# EAGLE design Button_PCBA (EAGLE 9.6.2)
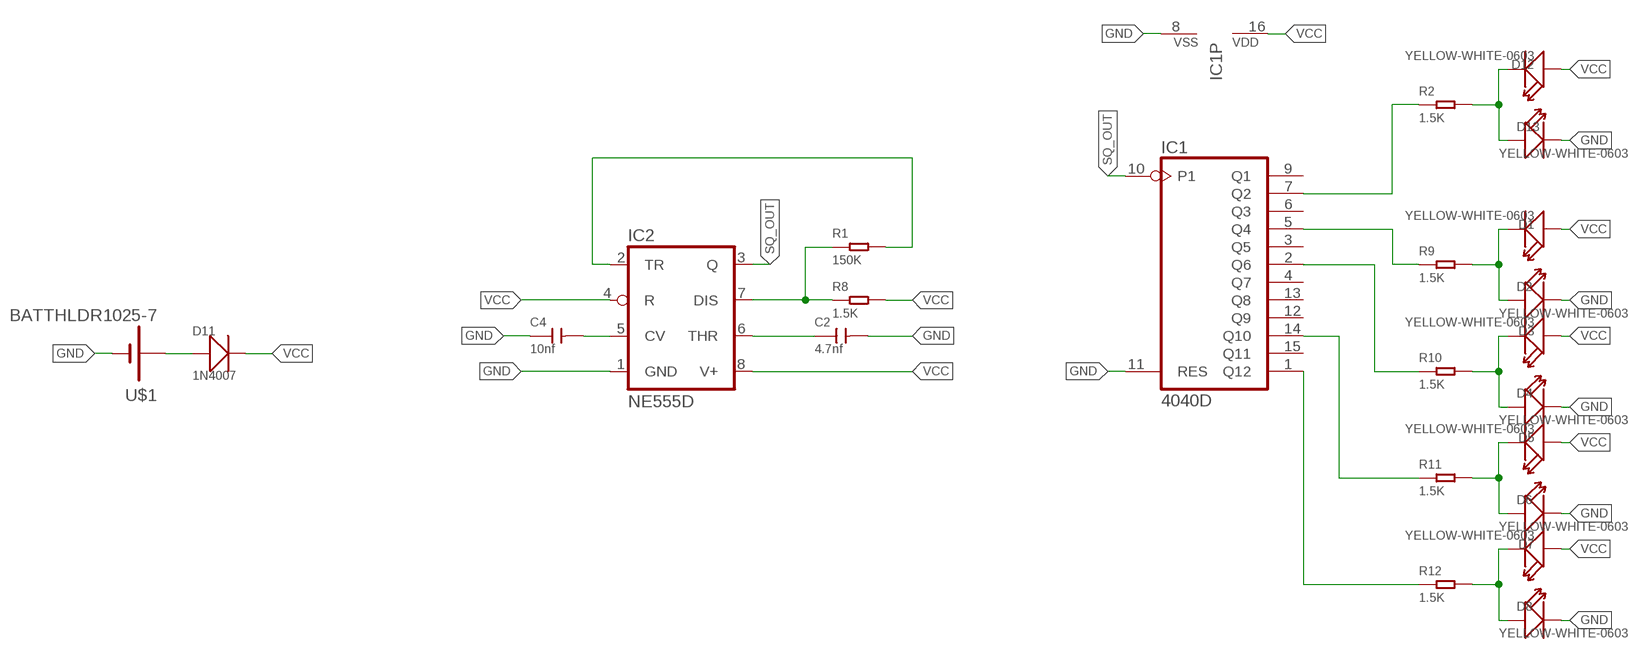
[diagram p0: schematic, sheet 1]

## Parts
C2  4.7nf  CERAMIC-4.7NF-50V-10%-X7R(0603)  [C0603]
C4  10nf  CERAMIC-10NF-50V-10%-X7R(0603)  [C0603]
D1  YELLOW-WHITE-0603  SMD-LED-YELLOW-WHITE(0603)  [LED-0603]
D2  YELLOW-WHITE-0603  SMD-LED-YELLOW-WHITE(0603)  [LED-0603]
D3  YELLOW-WHITE-0603  SMD-LED-YELLOW-WHITE(0603)  [LED-0603]
D4  YELLOW-WHITE-0603  SMD-LED-YELLOW-WHITE(0603)  [LED-0603]
D5  YELLOW-WHITE-0603  SMD-LED-YELLOW-WHITE(0603)  [LED-0603]
D6  YELLOW-WHITE-0603  SMD-LED-YELLOW-WHITE(0603)  [LED-0603]
D7  YELLOW-WHITE-0603  SMD-LED-YELLOW-WHITE(0603)  [LED-0603]
D8  YELLOW-WHITE-0603  SMD-LED-YELLOW-WHITE(0603)  [LED-0603]
D11  1N4007  DIODE-GEN-PURPOSE-1KV-1A(DO-214AC)  [DO-214AC]
D12  YELLOW-WHITE-0603  SMD-LED-YELLOW-WHITE(0603)  [LED-0603]
D13  YELLOW-WHITE-0603  SMD-LED-YELLOW-WHITE(0603)  [LED-0603]
IC1  4040D  [SO16]
IC2  NE555D  [SO08]
R1  150K  SMD-RES-150K-1%-1/10W(0603)  [R0603]
R2  1.5K  SMD-RES-680R-1%-1/10W(0603)  [R0603]
R8  1.5K  SMD-RES-4.7K-1%-1/10W(0603)  [R0603]
R9  1.5K  SMD-RES-680R-1%-1/10W(0603)  [R0603]
R10  1.5K  SMD-RES-680R-1%-1/10W(0603)  [R0603]
R11  1.5K  SMD-RES-680R-1%-1/10W(0603)  [R0603]
R12  1.5K  SMD-RES-680R-1%-1/10W(0603)  [R0603]
U$1  BATTHLDR1025-7  [BATTHLDR1025-7]

## Nets
+VBAT: D11.1(+) U$1.POSITIVE(+)
GND: C2.2 C4.1 D2.- D4.- D6.- D8.- D13.- IC1.8(VSS) IC1.11(RES) IC2.1(GND) U$1.NEGATIVE(-)
N$1: C2.1 IC2.6(THR)
N$2: IC2.7(DIS) R1.1 R8.1
N$3: IC2.2(TR) R1.2
N$4: C4.2 IC2.5(CV)
N$5: D12.- D13.+ R2.2
N$6: IC1.7(Q2) R2.1
N$7: D1.- D2.+ R9.2
N$8: IC1.5(Q4) R9.1
N$9: D3.- D4.+ R10.2
N$10: IC1.2(Q6) R10.1
N$11: D5.- D6.+ R11.2
N$12: IC1.14(Q10) R11.1
N$13: D7.- D8.+ R12.2
N$14: IC1.1(Q12) R12.1
SQ_OUT: IC1.10(P1) IC2.3(Q)
VCC: D1.+ D3.+ D5.+ D7.+ D11.2(-) D12.+ IC1.16(VDD) IC2.4(R) IC2.8(V+) R8.2
Unconnected: IC1.3(Q5) IC1.4(Q7) IC1.6(Q3) IC1.9(Q1) IC1.12(Q9) IC1.13(Q8) IC1.15(Q11)

## Library data of the parts
C2 = OPL_Capacitor:CERAMIC-4.7NF-50V-10%-X7R(0603): 302010144; MPN: CC0603KRX7R9BB472
C4 = OPL_Capacitor:CERAMIC-10NF-50V-10%-X7R(0603): 302010140; MPN: CC0603KRX7R9BB103
D1-D8 D12 D13 = OPL_Optoelectronics:SMD-LED-YELLOW-WHITE(0603): 304090071; MPN: ADL-0603W
D11 = OPL_Discrete_Semiconductor:DIODE-GEN-PURPOSE-1KV-1A(DO-214AC): 304010013; MPN: 1N4007
IC1 = 40xx:4040: 12-stage binary/ripple COUNTER
IC2 = linear:*555: TIMER
R1 = OPL_Resistor:SMD-RES-150K-1%-1/10W(0603): 301012036; MPN: RC0603FR-07150KL
R2 R9-R12 = OPL_Resistor:SMD-RES-680R-1%-1/10W(0603): 301012092; MPN: RC0603FR-071K5L
R8 = OPL_Resistor:SMD-RES-4.7K-1%-1/10W(0603): 301012079; MPN: RC0603FR-071K5L
U$1 = BATT_HLDR_COIN:BATTHLDR1025-7

## Net classes
0 default: width 0.305 mm, drill 0.305 mm, clearance 0.305 mm

## Board
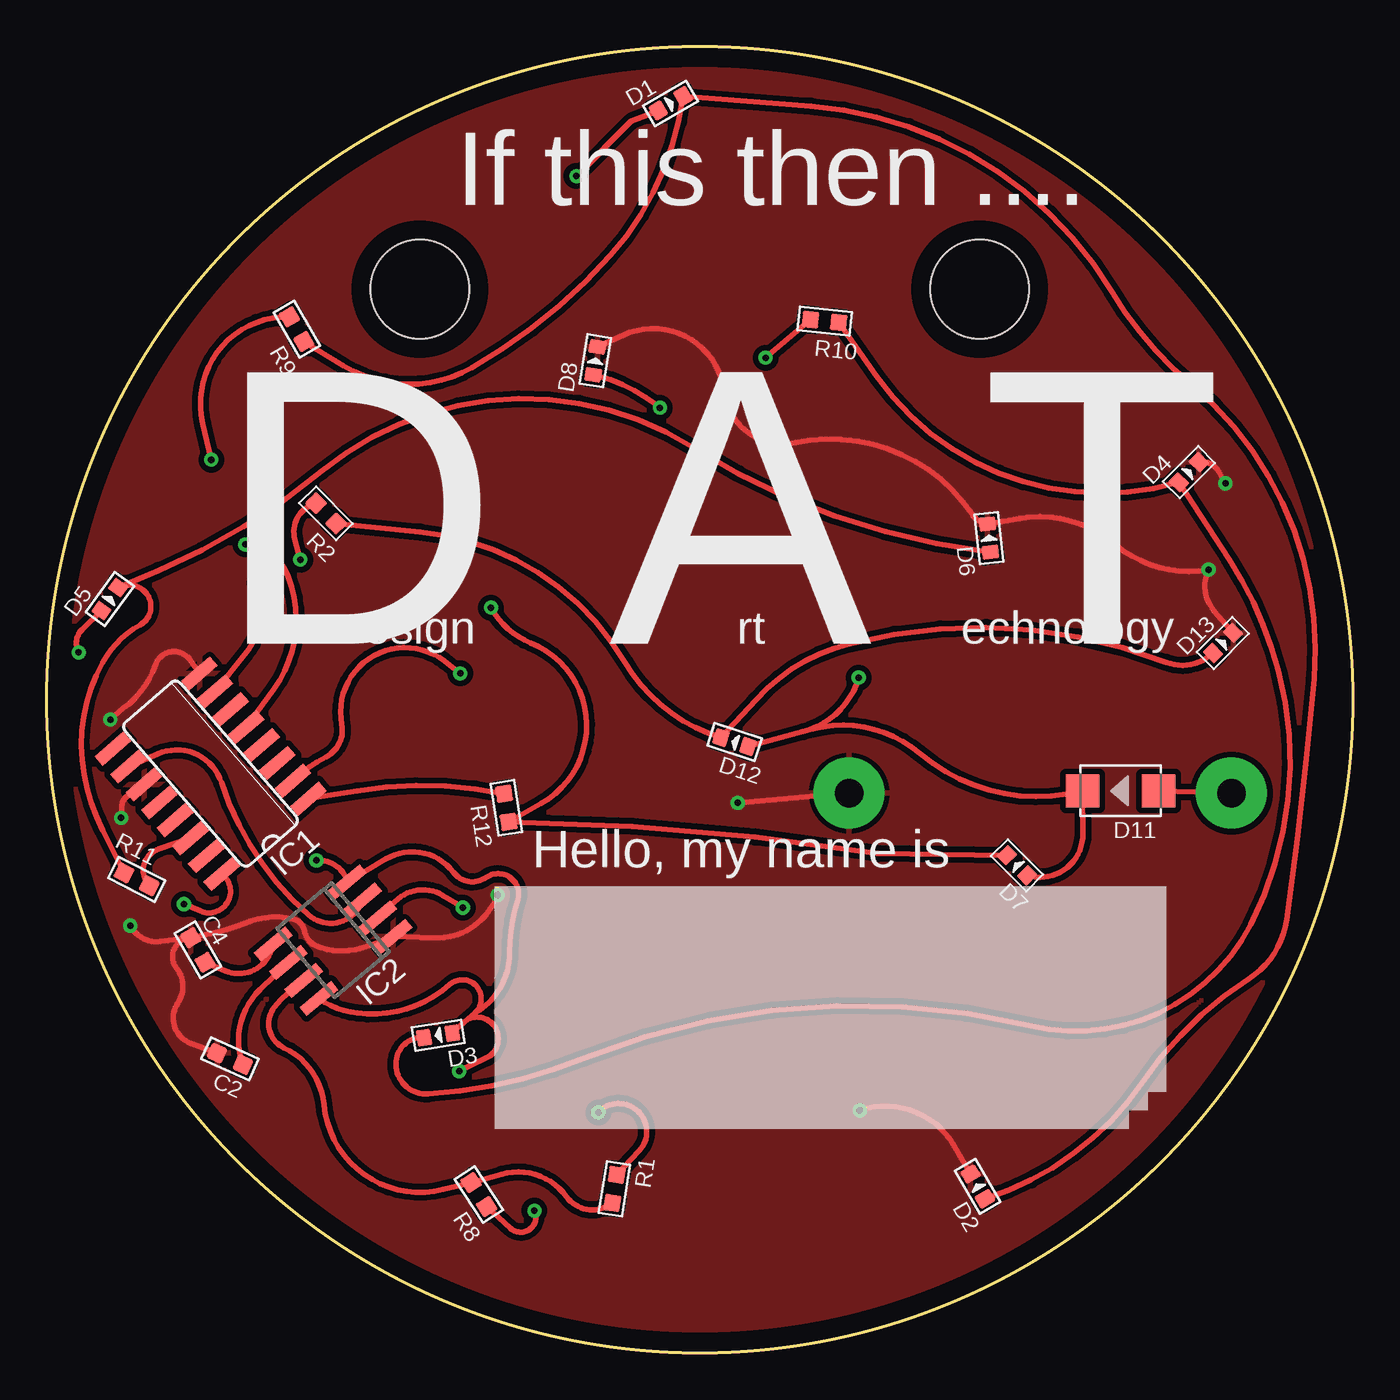
[diagram p1: board, top side]
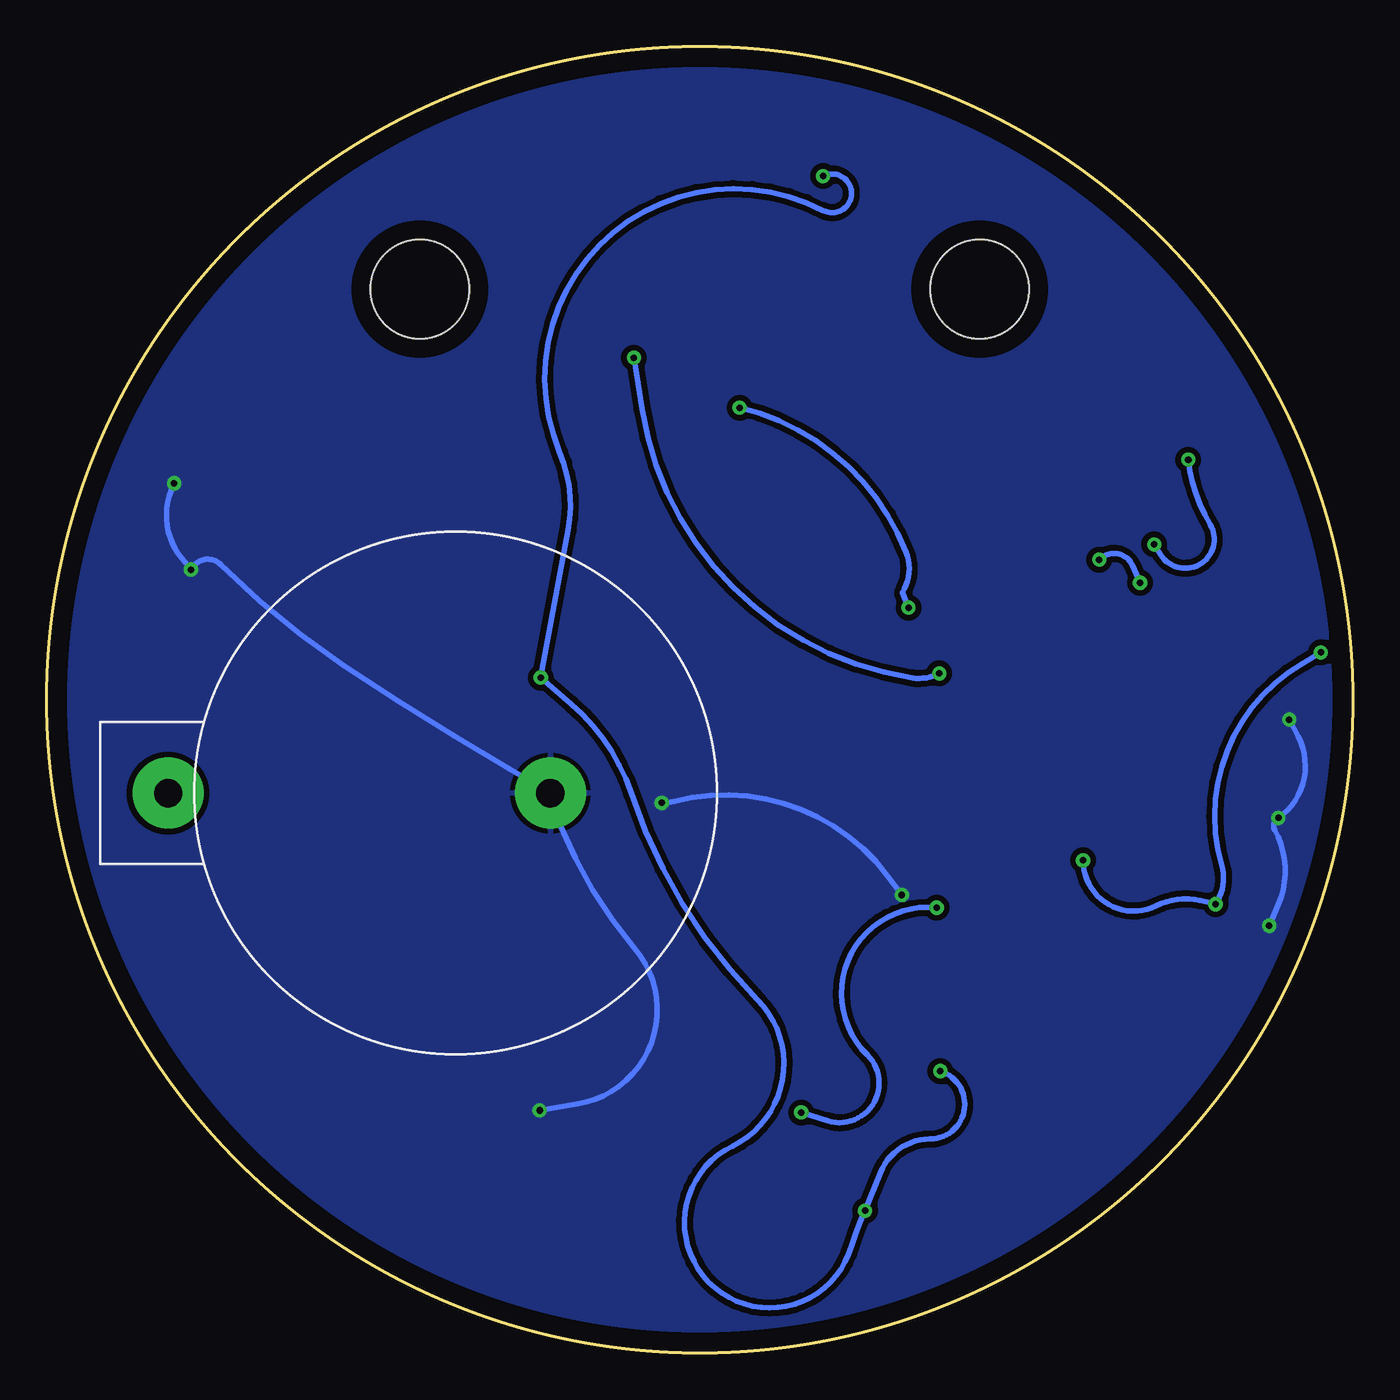
[diagram p2: board, bottom side, seen from below]

Size 70 x 70 mm. Coordinates in mm from the lower left corner, seen from the top.
Outline: circle at 35,35 radius 35
Copper layers (1*16): Top 0.035mm / dielectric 1.5mm / Bottom 0.035mm
Design rules "default": minimum track width 6mil, minimum drill 0.35mm, track to track 6mil, track to pad 6mil, pad to pad 6mil, via to via 6mil, smd to smd 6mil, copper to edge 40mil, drill to drill 6mil, minimum pad ring 10mil, minimum via ring 8mil, stop-mask expansion 4mil, vias tented up to drill 0mil, thermal gap 10mil
Holes 5.3 mm at 50,57 20,57

### Footprints (pad centres in the part's own frame; a part is rotated, then mirrored left to right if it is on the bottom)
C0603 = smd 0.889 x 0.889: 1 0,0.762; 2 0,-0.762
LED-0603 = smd 0.762 x 0.889: + -0.762,0; - 0.762,0
DO-214AC = smd 1.8 x 1.77: 1 -2.042,0; 2 2.042,0
SO16 = smd 0.66 x 2.032: 1 -4.445,-3.073; 2 -3.175,-3.073; 3 -1.905,-3.073; 4 -0.635,-3.073; 5 0.635,-3.073; 6 1.905,-3.073; 7 3.175,-3.073; 8 4.445,-3.073; 9 4.445,3.073; 10 3.175,3.073; 11 1.905,3.073; 12 0.635,3.073; 13 -0.635,3.073; 14 -1.905,3.073; 15 -3.175,3.073; 16 -4.445,3.073
SO08 = smd 0.6 x 2.2: 1 -1.905,-2.6; 2 -0.635,-2.6; 3 0.635,-2.6; 4 1.905,-2.6; 5 1.905,2.6; 6 0.635,2.6; 7 -0.635,2.6; 8 -1.905,2.6
R0603 = smd 0.889 x 0.889: 1 0,0.762; 2 0,-0.762
BATTHLDR1025-7 = drill 1.52 pad 3.81: NEGATIVE 0,0; POSITIVE 20.49,0

### Placement (x,y rotation side)
C2  9.82,15.75 246 top
C4  8.11,21.59 30 top
D1  33.44,66.96 30 top
D2  49.9,8.92 120 top
D3  20.98,17.02 189 top
D4  61.21,47.19 45 top
D5  3.39,40.4 54 top
D6  50.5,43.67 96 top
D7  52,26.13 135 top
D8  29.4,53.17 81 top
D11  57.56,30.12 180 top
D12  36.87,32.73 162 top
D13  63.04,38.05 45 top
IC1  8.79,31.04 131 top
IC2  15.35,22.12 130 top
R1  30.43,8.79 171 top
R2  14.97,44.99 45 top
R8  23.16,8.48 33 top
R9  13.4,54.86 30 top
R10  41.69,55.29 84 top
R11  4.82,25.37 243 top
R12  24.64,29.21 9 top
U$1  43,30 180 bottom

### Tracks (layer width: path | path; a pad name or v marks a point on that pad's centre or on a via)
+VBAT
  Top 0.305: D11.1 U$1.POSITIVE
GND  (via drill 0.35)
  Top 0.305: C4.1 6.08,22.04 arc-70 v4.48,22.89 | v3.99,28.67 4.02,29.27 arc-61 4.45,29.92 arc17 IC1.11 | IC1.8 7.69,37.13 arc126 5.84,36.88 arc-34 4.11,34.55 arc9 v3.41,33.94 | C2.2 7.71,16.59 arc-104 7.03,18.75 arc72 6.96,20.61 arc-127 C4.1 | C4.1 9.18,22.57 arc11 10.62,23.02 arc-36 13.2,23.25 arc-67 13.82,22.6 arc58 14.45,21.81 arc38 16.8,21.68 arc9 IC2.1 20.7,22.23 arc73 v24.17,24.54 | D8.- 30.92,54.55 arc-107 36.32,51.5 arc95 40.12,48.77 arc-68 49.58,44.97 arc46 D6.- 52.12,44.72 arc-50 57.29,43.3 arc50 v62.27,41.97 arc66 62.58,39.74 D13.- | v63.17,46.59 62.81,47.22 arc70 D4.- | D2.- 48.66,11.08 arc79 v43.58,13 | v37.04,29.48 U$1.NEGATIVE
  Bottom 0.305: v4.48,22.89 3.99,24.04 arc-52 4.19,28.02 arc91 v3.99,28.67 arc-83 2.94,33.03 v3.41,33.94 | v63.17,46.59 arc0 63.33,46.2 arc-61 62.78,42.6 v62.27,41.97 arc109 60.67,42.24 arc-11 54.09,36.83 arc-3 45.2,31.29 43.09,30.05 | U$1.NEGATIVE 43.09,30.05 | v43.58,13 41.55,13.34 arc-121 38.5,21.69 arc23 43.09,30.05 | v24.17,24.54 24.93,25.56 arc-68 36.37,29.55 arc16 v37.04,29.48
  pour Bottom: -5,75 75,75 75,-5 -5,-5
  pour Top: -15,85 85,85 85,-15 -15,-15
N$1
  Top 0.305: IC2.6 11.45,19.49 arc67 C2.1
N$2
  Top 0.305: R1.1 arc-93 27.87,8.36 arc69 24.38,9.58 R8.1 21.25,8.75 arc-98 14.86,13.3 arc60 12.71,16.35 arc-103 12.2,18.51 arc-18 IC2.7
N$3  (via drill 0.35)
  Top 0.305: R1.2 31.76,10.84 arc180 v29.56,12.88 | v22.31,23.86 21.23,24.52 arc72 18.83,24.33 arc7 IC2.2
  Bottom 0.305: v29.56,12.88 28.14,12.43 arc-153 26.02,15.96 arc141 v22.31,23.86
N$4
  Top 0.305: C4.2 9.57,20.47 arc104 IC2.5
N$5
  Top 0.305: R2.2 20,44 arc-53 31,37 arc42 D12.- 38,35 arc-33 43,38 arc-35 60,37 arc65 D13.+
N$6  (via drill 0.35)
  Top 0.305: IC1.7 10.62,37.41 arc52 11.4,40.78 arc-26 v11.4,41.27 | v13.59,42.51 13.3,43.6 arc-90 R2.1 | R2.1 | 14.5,45.5 R2.1
  Bottom 0.305: v11.4,41.27 11.83,42.21 arc-113 v13.59,42.51
N$7
  Top 0.305: D2.+ arc38 58.74,14.52 arc-23 64.43,20.05 arc49 66.46,23.21 arc3 67.92,36.14 arc55 61.34,51.91 arc-19 57.07,56.87 arc54 40.95,66.81 D1.- arc-35 30.2,58.8 arc-18 22.8,52.8 arc-61 15.9,52.9 R9.2 | R9.2 | 13.75,54.25 R9.2
N$8  (via drill 0.35)
  Top 0.305: IC1.5 12.16,35.54 arc78 11.73,43.55 arc119 v10.65,43.32 | v8.82,47.86 8.36,49.81 arc-104 13,55.52 | 13,55.52 arc0 R9.1 13,55.5 13,55.52
  Bottom 0.305: v10.65,43.32 10.29,42.77 arc-178 7.65,44.4 arc24 v8.82,47.86
N$9
  Top 0.305: R10.2 44.48,52.34 arc71 D4.+ | D4.+ 63.37,42.52 arc-18 66.01,36.56 arc-42 64.52,22.95 arc-76 52.74,17.53 arc35 28.77,15.77 arc-18 20.44,13.87 arc-104 18.75,15.77 arc-85 D3.- | D4.+
N$10  (via drill 0.35)
  Top 0.305: R10.1 v38.53,53.33 | v22.16,36.41 21.32,37.07 arc139 15.82,33.68 arc-74 14.97,31.94 arc18 IC1.2
  Bottom 0.305: v38.53,53.33 38.09,50.59 arc-72 23.59,36.17 arc-36 v22.16,36.41
N$11
  Top 0.305: R11.2 3,28 arc-16 2,31 arc-39 3,37 arc-32 5,39 arc122 5,41 arc57 D5.- | D5.- 3.97,41.07 | 3.97,41.07 6,41.94 arc17 14.74,47.24 arc-72 34.6,48.54 arc25 50.49,42.92 | 50.49,42.92 arc0 D6.+ 50.5,43 50.49,42.92 | D5.- 3.97,41.07
N$12
  Top 0.305: IC1.14 6,27 arc114 R11.1
N$13  (via drill 0.35)
  Top 0.305: D7.- 44.53,26.76 arc8 R12.2 26.5,29.44 arc129 25.93,38.05 arc-40 v23.81,39.94 | v32.86,50.66 32.7,50.78 arc23 29.53,52.36 | 29.53,52.36 arc2 D8.+ 29.5,52.25 29.53,52.36 | D7.- | 51.5,26.75 D7.-
  Bottom 0.305: v23.81,39.94 24.14,40.76 arc-53 23.94,42.9 arc-55 v32.86,50.66
N$14
  Top 0.305: IC1.1 16.63,30.12 arc-21 R12.1
SQ_OUT
  Top 0.305: IC1.10 5.95,32.1 arc-96 9.37,30.56 arc31 14.04,23.47 arc114 IC2.3
VCC  (via drill 0.35)
  Top 0.305: 40.54,33.29 41.04,33.42 arc-55 46.79,32.12 arc55 D11.2 55.53,27.81 arc-108 D7.+ | D12.+ 40.54,33.29 | 40.54,33.29 arc58 v43.52,36.19 | D1.+ 31.33,66 v28.39,63.06 | D3.+ 22.59,17.89 | 22.59,17.89 22.95,18.21 | 22.95,18.21 arc180 21.6,19.74 arc-48 16.65,18.21 arc-28 IC2.8 | 22.95,18.21 arc60 24.81,21.48 arc-19 25.24,24.23 arc143 23.56,25.48 arc-88 21.8,25.76 arc84 18.15,26.46 IC2.4 arc74 14.6,26.4 v14.45,26.4 | D5.+ 1.9,38.76 arc73 v1.71,37.54 | v7.36,24.05 8.25,23.67 arc166 IC1.16 | R8.2 24.85,6.68 arc157 v26.15,7.62 | v22.11,15.1 23.56,15.8 arc178 22.59,17.89 | D12.+ | 37.5,32.5 D12.+ | D5.+ | 3,39.75 D5.+ | D7.+ | 52.5,25.5 D7.+
  Bottom 0.305: v28.39,63.06 arc235 28.39,61.22 arc-141 42.51,48.26 arc33 42.05,44.08 v43.52,36.19 41.88,34.77 arc31 38.67,29.98 arc-26 31.9,18.92 arc109 33.25,11.08 arc-228 26.87,5.72 arc10 v26.15,7.62 25.32,9.66 arc68 22.66,11.46 arc-163 v22.11,15.1 | v1.71,37.54 2.75,36.93 arc-76 7.03,26.12 arc51 v7.36,24.05 8.2,24.23 arc-39 10.55,23.95 arc117 v14.45,26.4

### Text on the board
tNames: If this then .... | D A T | esign | rt | echnology | Hello, my name is